# Altium project 4_Airsense_PowerSup.PrjPcb
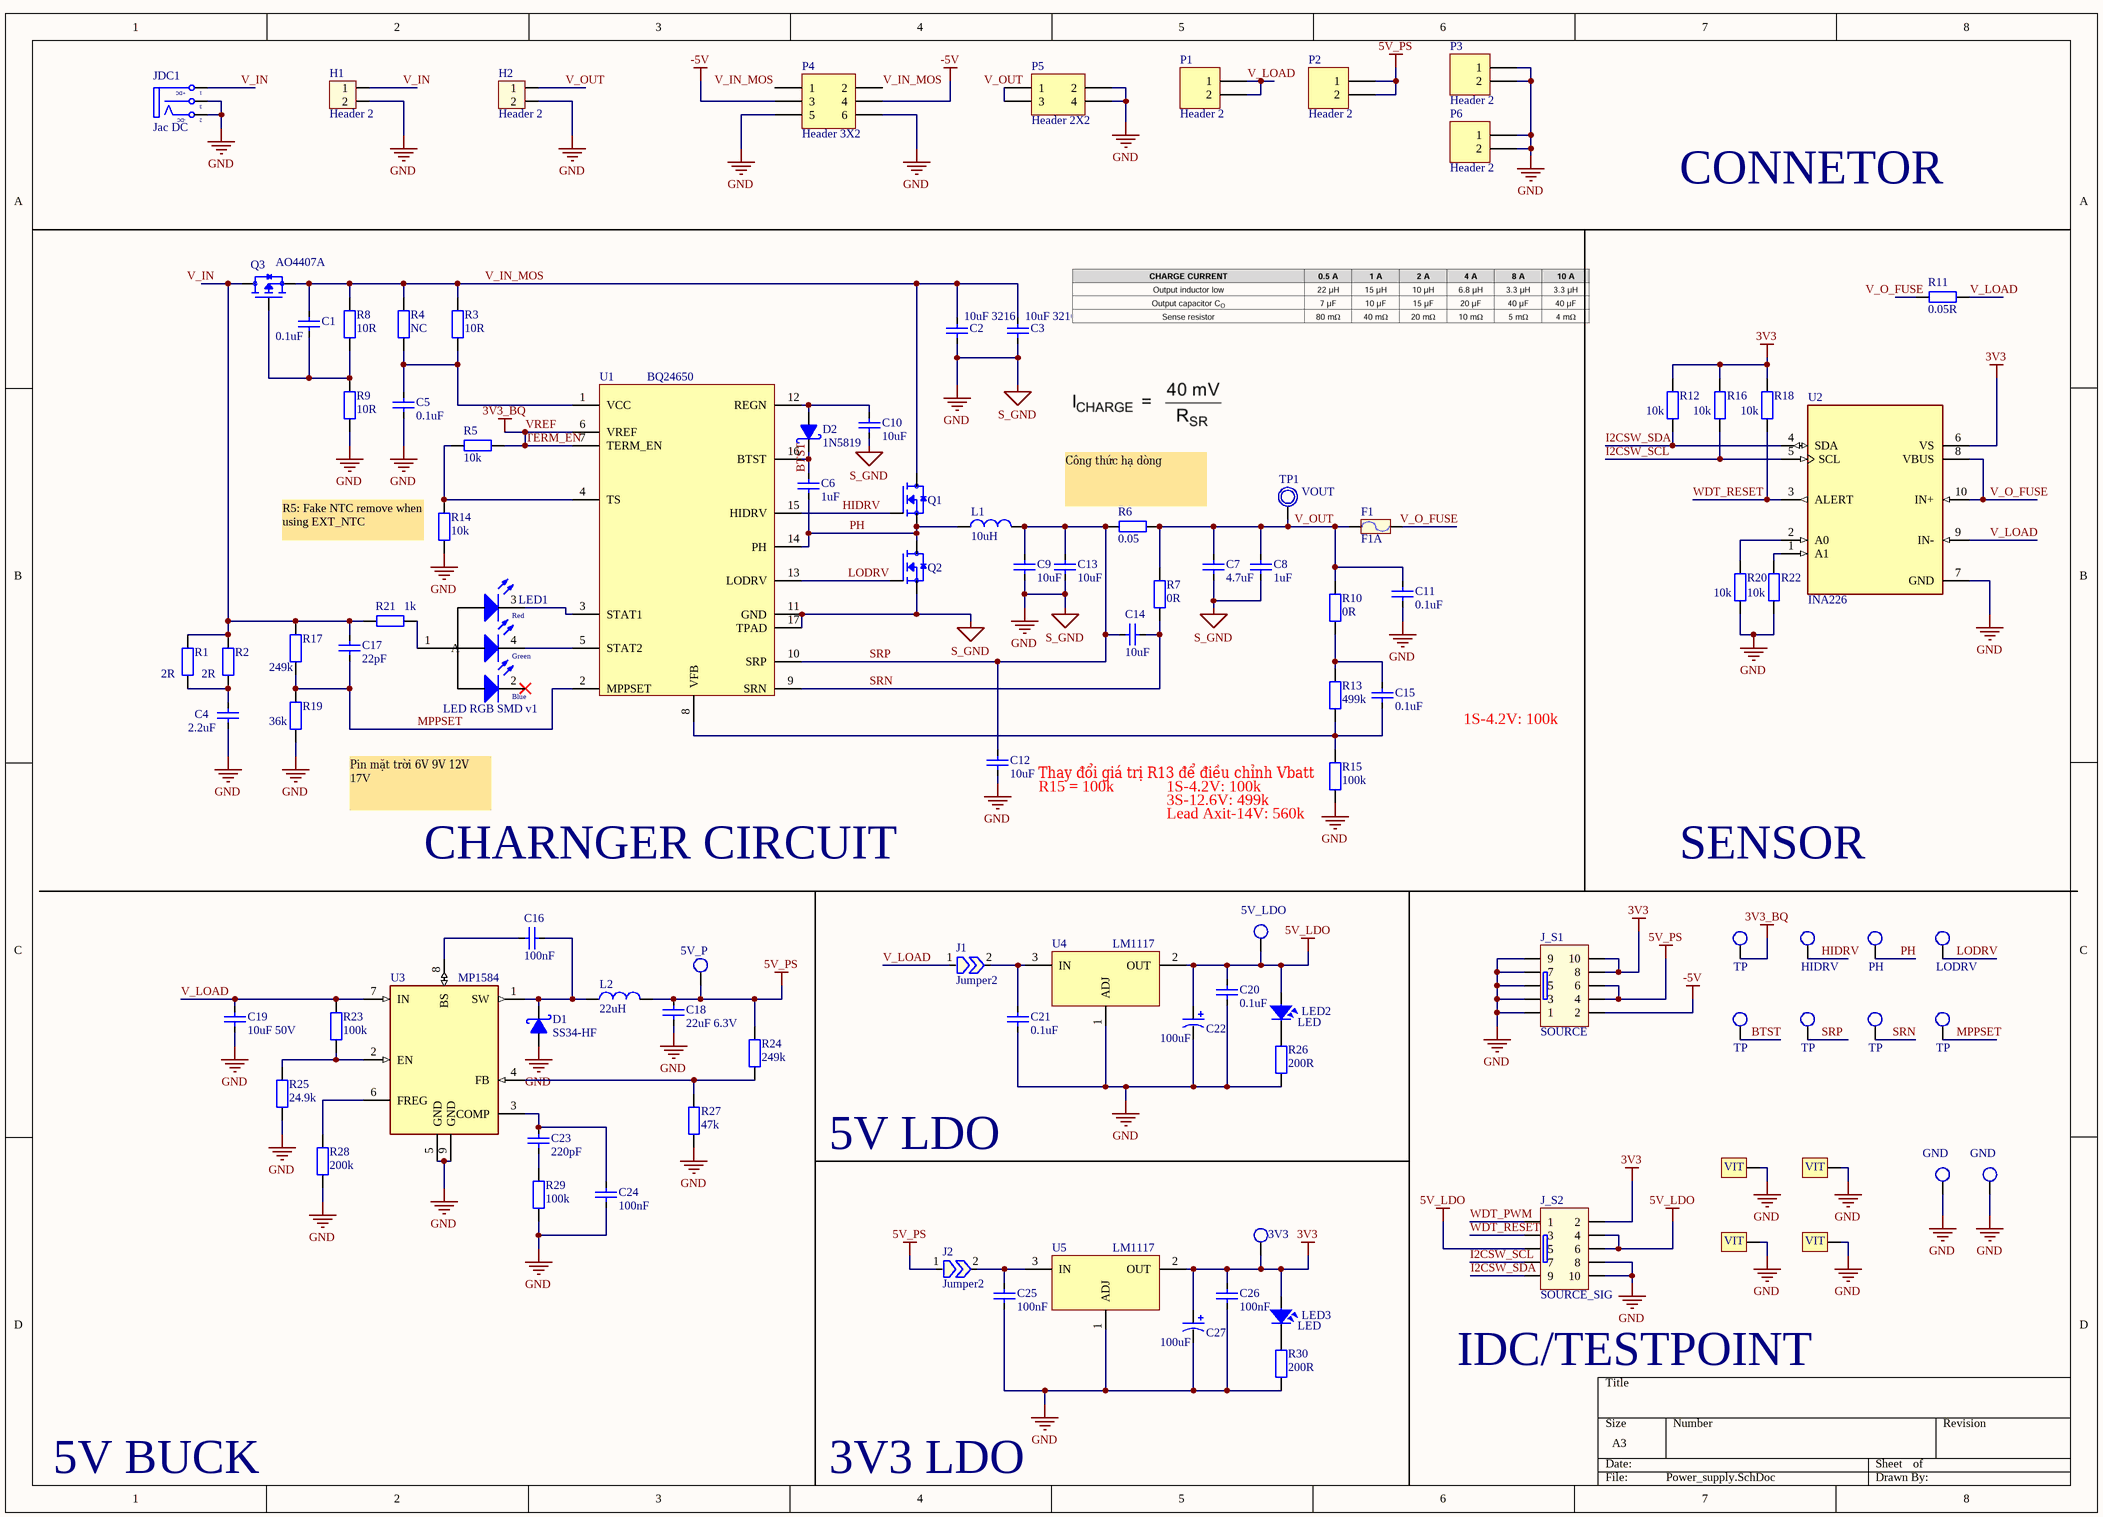
[diagram p0: Power_supply.SchDoc]
1 sheet, 104 parts. Net scope: global (net labels, ports and power ports of the same name join across sheets).
Board file: Power_supply_ver5.0.1.PcbDoc

## Sheet Power_supply.SchDoc
size A3; SheetNumber: 1; SheetTotal: 1

### Parts
C1  0.1uF  [CAP_0805]
C2  10uF 3216  [CAP_3216]
C3  10uF 3216  [CAP_3216]
C4  2.2uF  [CAP_0805]
C5  0.1uF  [CAP_0805]
C6  1uF  [CAP_0805]
C7  4.7uF  [CAP_1206]
C8  1uF  [CAP_1206]
C9  10uF  [CAP_1206]
C10  10uF  [CAP_0805]
C11  0.1uF  [CAP_0805]
C12  10uF  [CAP_0805]
C13  10uF  [CAP_1206]
C14  10uF  [CAP_0805]
C15  0.1uF  [CAP_0805]
C16  100nF  [CAP_0805]
C17  22pF  [CAP_0805]
C18  22uF 6.3V  [CAP_0805]
C19  10uF 50V  [CAP_3216]
C20  0.1uF  [CAP_0805]
C21  0.1uF  [CAP_0805]
C22  100uF  [CAP_7343]
C23  220pF  [CAP_0805]
C24  100nF  [CAP_0805]
C25  100nF  [CAP_0805]
C26  100nF  [CAP_0805]
C27  100uF  [CAP_7343]
D1  SS34-HF  [SMA]
D2  1N5819  [SMA]
F1  F1A  [RES-SMD-1812]
H1  Header 2  [HED2]
H2  Header 2  [HED2]
J1  Jumper2  [JUMPER2]  (no BOM)
J2  Jumper2  [JUMPER2]  (no BOM)
J_S1  SOURCE  [IDC10]
J_S2  SOURCE_SIG  [IDC10]
JDC1  Jac DC  [DC-IN]
L1  10uH  [L-SMD-M-12x10]
L2  22uH  [L-SMD-M-7.3x4.5]
LED1  LED RGB SMD v1  [LED RGB 3528]
LED2  LED  [LED-0805-Blue]
LED3  LED  [LED-0805-Blue]
P1  Header 2  [HDR1X2]
P2  Header 2  [HDR1X2]
P3  Header 2  [HDR1X2]
P4  Header 3X2  [HDR2X3]
P5  Header 2X2  [HDR2X2]
P6  Header 2  [HDR1X2]
P7  5V_P  [Testpoint 50ml]  (no BOM)
P8  5V_LDO  [Testpoint 50ml]  (no BOM)
P9  GND  [Testpoint 50ml]  (no BOM)
P10  GND  [Testpoint 50ml]  (no BOM)
P11  3V3  [Testpoint 50ml]  (no BOM)
Q1  AON6508  [MOSFET_HP_8Pin]  (value not drawn)
Q2  AON6508  [MOSFET_HP_8Pin]  (value not drawn)
Q3  AO4407A  [SOIC-8]
R1  2R  [RES-SMD-2512]
R2  2R  [RES-SMD-2512]
R3  10R  [RES-SMD-0805]
R4  NC  [RES-SMD-0805]
R5  10k  [RES-SMD-0805]
R6  0.05  [RES-SMD-2512]
R7  0R  [RES-SMD-0805]
R8  10R  [RES-SMD-0805]
R9  10R  [RES-SMD-0805]
R10  0R  [RES-SMD-0805]
R11  0.05R  [RES-SMD-2512]
R12  10k  [RES-SMD-0805]
R13  499k  [RES-SMD-0805]
R14  10k  [RES-SMD-0805]
R15  100k  [RES-SMD-0805]
R16  10k  [RES-SMD-0805]
R17  249k  [RES-SMD-0805]
R18  10k  [RES-SMD-0805]
R19  36k  [RES-SMD-0805]
R20  10k  [RES-SMD-0805]
R21  1k  [RES-SMD-0805]
R22  10k  [RES-SMD-0805]
R23  100k  [RES-SMD-0805]
R24  249k  [RES-SMD-0805]
R25  24.9k  [RES-SMD-0805]
R26  200R  [RES-SMD-0805]
R27  47k  [RES-SMD-0805]
R28  200k  [RES-SMD-0805]
R29  100k  [RES-SMD-0805]
R30  200R  [RES-SMD-0805]
TP1  VOUT  [TP1]
TP2  TP  [Testpoint 50ml]
TP3  HIDRV  [Testpoint 50ml]
TP4  PH  [Testpoint 50ml]
TP5  LODRV  [Testpoint 50ml]
TP6  TP  [Testpoint 50ml]
TP7  TP  [Testpoint 50ml]
TP8  TP  [Testpoint 50ml]
TP9  TP  [Testpoint 50ml]
U1  BQ24650  [VQFN-16]
U2  INA226  [VSSOP-10]
U3  MP1584  [SOP8-PP]
U4  LM1117  [SOT-223]
U5  LM1117  [SOT-223]
VIT1  1  [Screw Hole 4mm]  (value not drawn)  (net tie, no BOM)
VIT2  1  [Screw Hole 4mm]  (value not drawn)  (net tie, no BOM)
VIT3  1  [Screw Hole 4mm]  (value not drawn)  (net tie, no BOM)
VIT4  1  [Screw Hole 4mm]  (value not drawn)  (net tie, no BOM)

### Nets
3V3: C26.2 C27.1 J_S1.8 J_S1.10 J_S2.2 LED3.1 P11.1 R12.1 R16.1 R18.1 U2.6(VS) U5.2(OUT)
5V_LDO: C20.2 C22.1 J_S2.4 J_S2.5 J_S2.6 LED2.1 P8.1 U4.2(OUT)
5V_PS: C18.2 J2.1 J_S1.4 J_S1.6 L2.2 P2.1 P2.2 P7.1 R24.1
-5V: J_S1.2 P4.3 P4.4
GND: C2.1 C3.1 C4.1 C5.1 C7.2 C8.2 C9.1 C10.1 C11.1 C12.1 C13.1 C18.1 C19.1 C20.1 C21.1 C22.2 C24.1 C25.1 C26.1 C27.2 D1.1(A) H1.2 H2.2 J_S1.1 J_S1.3 J_S1.5 J_S1.7 J_S1.9 J_S2.8 J_S2.10 JDC1.2(TN) JDC1.3(S) P3.1 P3.2 P4.5 P4.6 P5.2 P5.4 P6.1 P6.2 P9.1 P10.1 Q2.1,2,3(S) R9.2 R14.2 R15.2 R19.2 R20.2 R22.2 R25.2 R26.2 R27.2 R28.2 R29.2 R30.2 U1.11(GND) U1.17(TPAD) U2.7(GND) U3.5(GND) U3.9(GND) U4.1(ADJ) U5.1(ADJ) VIT1.VIT1 VIT2.VIT1 VIT3.VIT1 VIT4.VIT1  [also labelled S_GND]
TERM_EN: R5.2 TP2.1 U1.6(VREF) U1.7(TERM_EN)  [also labelled 3V3_BQ, VREF]
BTST: C6.2 D2.2(K) TP6.1 U1.16(BTST)
HIDRV: Q1.4(G) TP3.1 U1.15(HIDRV)
I2CSW_SCL: J_S2.7 R16.2 U2.5(SCL)
I2CSW_SDA: J_S2.9 R12.2 U2.4(SDA)
LODRV: Q2.4(G) TP5.1 U1.13(LODRV)
MPPSET: C17.1 R17.2 R19.1 TP9.1 U1.2(MPPSET)
PH: C6.1 L1.1 Q1.1,2,3(S) Q2.5,6,7,8,9(D) TP4.1 U1.14(PH)
SRN: C14.1 R7.2 TP8.1 U1.9(SRN)
SRP: C9.2 C12.2 C13.2 C14.2 L1.2 R6.2 TP7.1 U1.10(SRP)
V_IN: C17.2 H1.1 JDC1.1(T) Q3.5,_6,_7,_8(D) R1.1 R2.1 R17.1 R21.2
V_IN_MOS: C1.2 C2.2 C3.2 P4.1 P4.2 Q1.5,6,7,8,9(D) Q3.1,_2,_3(S) R3.1 R4.1 R8.1
V_LOAD: C19.2 J1.1 P1.1 P1.2 R11.1 R23.1 U2.9(IN-) U3.7(IN)
V_O_FUSE: F1.2 R11.2 U2.8(VBUS) U2.10(IN+)
V_OUT: C7.1 C8.1 C11.2 F1.1 H2.1 P5.1 P5.3 R6.1 R7.1 R10.1 TP1.1
WDT_PWM: J_S2.1
WDT_RESET: J_S2.3 R18.2 U2.3(ALERT)
NetC1_1: C1.1 Q3.4(G) R8.2 R9.1
NetC4_2: C4.2 R1.2 R2.2
NetC5_2: C5.2 R3.2 R4.2 U1.1(VCC)
NetC10_2: C10.2 D2.1(A) U1.12(REGN)
NetC15_1: C15.1 R13.2 R15.1 U1.8(VFB)
NetC15_2: C15.2 R10.2 R13.1
NetC16_1: C16.1 U3.8(BS)
NetC16_2: C16.2 D1.2(K) L2.1 U3.1(SW)
NetC21_2: C21.2 J1.2 U4.3(IN)
NetC23_1: C23.1 R29.1
NetC23_2: C23.2 C24.2 U3.3(COMP)
NetC25_2: C25.2 J2.2 U5.3(IN)
NetLED1_1: LED1.1(A) R21.1
NetLED1_3: LED1.3(C2) U1.3(STAT1)
NetLED1_4: LED1.4(C1) U1.5(STAT2)
NetLED2_2: LED2.2 R26.1
NetLED3_2: LED3.2 R30.1
NetR5_1: R5.1 R14.1 U1.4(TS)
NetR20_1: R20.1 U2.2(A0)
NetR22_1: R22.1 U2.1(A1)
NetR23_2: R23.2 R25.1 U3.2(EN)
NetR24_2: R24.2 R27.1 U3.4(FB)
NetR28_1: R28.1 U3.6(FREG)

Not connected (* = marked no-connect by the designer): LED1 2(C3)*

### Notes on the sheet
- CONNETOR
- (near R6) Công thức hạ dòng
- (near R14) R5: Fake NTC remove when using EXT_NTC
- 1S-4.2V: 100k
- (near R15) Thay đổi giá trị R13 để điều chỉnh Vbatt
- (near C12) R15 = 100k
- Pin mặt trời 6V 9V 12V 17V
- CHARNGER CIRCUIT
- 3S-12.6V: 499k
- (near R15) Lead Axit-14V: 560k
- SENSOR
- 5V LDO
- (near J_S2) IDC/TESTPOINT
- 5V BUCK
- 3V3 LDO
- (in symbol DCIN) +DC; -DC
- (in symbol LED RGB SMD v1) Red; Green; Blue

### Library data of the parts
C1-C15 C17 = CapSMD: Capacitor; Value: 33p; Published: 8-Jun-2000; LatestRevisionDate: 17-Jul-2002; LatestRevisionNote: Re-released for DXP Platform.; PackageReference: RAD-0.3; Publisher: Altium Limited
C16 C18 C20 C21 C23-C26 = CapSMD: C 0805; Value: 33p; Published: 8-Jun-2000; LatestRevisionDate: 17-Jul-2002; LatestRevisionNote: Re-released for DXP Platform.; PackageReference: RAD-0.3; Publisher: Altium Limited
C19 = CapSMD: C 1206; Value: 33p; Published: 8-Jun-2000; LatestRevisionDate: 17-Jul-2002; LatestRevisionNote: Re-released for DXP Platform.; PackageReference: RAD-0.3; Publisher: Altium Limited
C22 C27 = CAP_TAN_SMD: C Tan 7343
D1 D2 = 1N5822: Schottky Rectifiers; Value: Diode c?m 1N5408
F1 = Fuse: Fuse 5A; Designed by: VanDungEvn; Value: Fuse
H1 H2 = Hed2: Header 2 (Green); Value: Header 2
J1 J2 = Jumper2: Jumper, 2-Pin
J_S1 J_S2 = IDC 5X2: Value: Header 5x2
JDC1 = DCIN: Jac DC input; Value: Jac DC
L1 = Inductor: Value: 150 mH
L2 = Inductor: 6.8-10uH; Value: 150 mH
LED2 LED3 = LED: LED Single colour Green and Red; Value: LED 3 ly Single Colour
P1-P3 P6 = Header 2: Header, 2-Pin; LatestRevisionDate: 17-Jul-2002; LatestRevisionNote: Re-released for DXP Platform.; Publisher: Altium Limited
P4 = Header 3X2: Header, 3-Pin, Dual row; LatestRevisionDate: 17-Jul-2002; LatestRevisionNote: Re-released for DXP Platform.; Publisher: Altium Limited
P5 = Header 2X2: Header, 2-Pin, Dual row; LatestRevisionDate: 17-Jul-2002; LatestRevisionNote: Re-released for DXP Platform.; Publisher: Altium Limited
P7-P11 TP2-TP9 = TP_1: Test Point; Value: Test Point
Q1 Q2 = MOSFET-N: MFET-CHP
Q3 = MOSFET-P: MFET-ChP; ComponentLink1Description: New link; ComponentLink1URL: https://linhkien.cxtvn.com/3834-ru20p7c-mosfet-p-ch-5a-20v-sot-23.html
R1 R2 R6 = Resistor - SMD: Resistor - SMD 2512; Manufacturer: Generic Components; Class: Passive; Published: 08/06/2000; Publisher: Altium Hobart Technology Centre
R3-R5 R7 R10 R13-R15 R17 R19 R21 = Resistor - SMD: Resistor - SMD 0805; Manufacturer: Generic Components; Class: Passive; Published: 08/06/2000; Publisher: Altium Hobart Technology Centre
R8 R9 R12 R16 R18 R20 R22 R23 R26 R28-R30 = Resistor - SMD: R 0805; Manufacturer: Generic Components; Class: Passive; Published: 08/06/2000; Publisher: Altium Hobart Technology Centre
R11 = Resistor - SMD: R 2512 1%; Manufacturer: Generic Components; Class: Passive; Published: 08/06/2000; Publisher: Altium Hobart Technology Centre
R24 R25 R27 = Resistor - SMD: R 0805 1%; Manufacturer: Generic Components; Class: Passive; Published: 08/06/2000; Publisher: Altium Hobart Technology Centre
TP1 = TP1: Test Point; Value: Test Point
U1 = BQ24650: BQ24650 Stand-Alone Synchronous Buck Battery Charge Controller for Solar Power / With Maximum Power Point Tracking
U2 = INA226: Current Sensing IC
U3 = MP1584: MP1584, The wide 4.5V to 28V input range accommodates a   variety   of   step-down   applications, SOIC8E
U4 U5 = LM1117: 3V3 5V LDO, AMS1117, LDI1117; Creator: Nguyen Ba Bien; Website: http://group3i.net
VIT1-VIT4 = VIT: Oc Vit